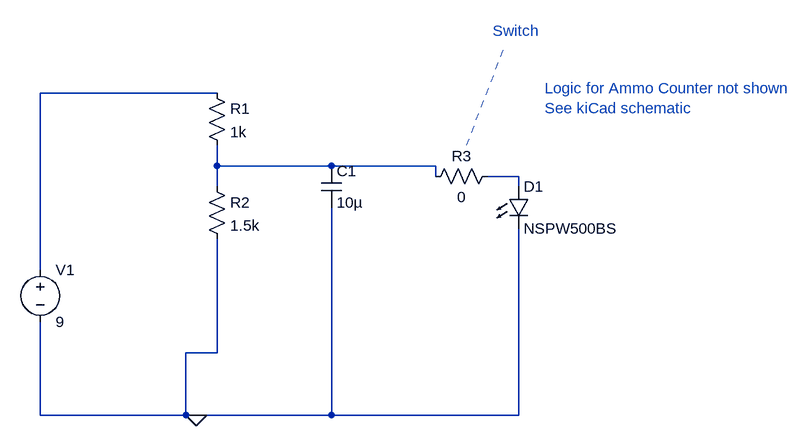
[diagram p0: schematic laserTransmitter.asc]
laserTransmitter.asc, the LTspice schematic file:
Version 4
SHEET 1 1048 680
WIRE 160 112 -112 112
WIRE 160 224 160 192
WIRE 336 224 160 224
WIRE 496 224 336 224
WIRE 496 240 496 224
WIRE 624 240 576 240
WIRE 160 256 160 224
WIRE 624 256 624 240
WIRE -112 384 -112 112
WIRE 160 512 160 336
WIRE 160 512 112 512
WIRE -112 608 -112 464
WIRE 112 608 112 512
WIRE 112 608 -112 608
WIRE 128 608 112 608
WIRE 336 608 336 288
WIRE 336 608 128 608
WIRE 624 608 624 320
WIRE 624 608 336 608
FLAG 128 608 0
SYMBOL Voltage -112 368 R0
SYMATTR InstName V1
SYMATTR Value 9
SYMBOL Res 144 96 R0
SYMATTR InstName R1
SYMATTR Value 1k
SYMBOL Res 144 240 R0
SYMATTR InstName R2
SYMATTR Value 1.5k
SYMBOL Cap 320 224 R0
SYMATTR InstName C1
SYMATTR Value 10µ
SYMBOL Res 592 224 R90
WINDOW 0 0 56 VBottom 2
WINDOW 3 32 56 VTop 2
SYMATTR InstName R3
SYMATTR Value 0
SYMBOL LED 608 256 R0
SYMATTR InstName D1
SYMATTR Value NSPW500BS
SYMATTR Description Diode
SYMATTR Type diode
TEXT 584 16 Left 2 ;Switch
TEXT 664 104 Left 2 ;Logic for Ammo Counter not shown\nSee kiCad schematic
LINE Normal 544 192 604 36 2

The netlist it stands for:
* laserTransmitter.asc
V1 N001 0 9
R1 N001 N002 1k
R2 N002 0 1.5k
C1 N002 0 10µ
R3 N003 N002 0
D1 N003 0 NSPW500BS
.model D D
.lib standard.dio
* Switch
* Logic for Ammo Counter not shown
* See kiCad schematic
.backanno
.end